# Altium schematic sheet AD_2.SchDoc
size A2; Date: Date; CompanyName: HESSO; Engineer: Name; Address1: Route du Rawyl 47; Address2: 1950 Sion; Address3: Switzerland; DocumentNumber: 7; SheetNumber: 7; SheetTotal: 8; ProjectName: Project Name
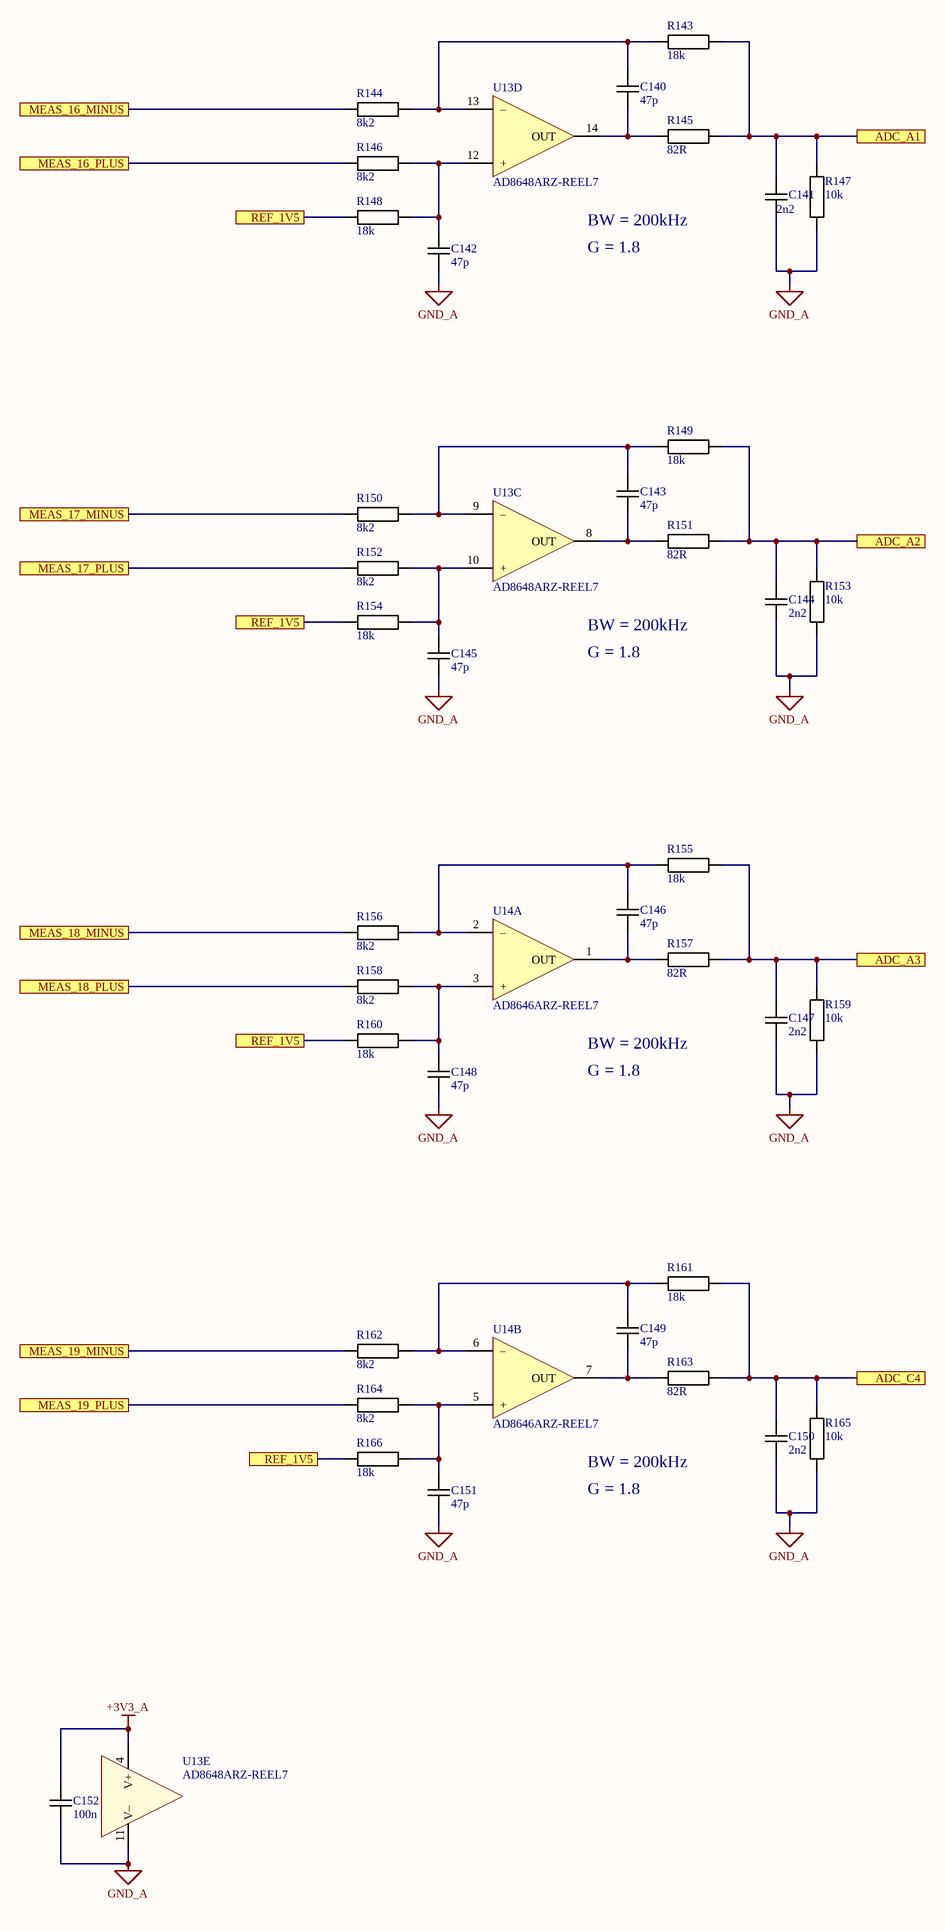
[diagram p0: AD_2.SchDoc]

## Parts
C140  47p  [CAPACITOR 1608 REFLOW]
C141  2n2  [CAPACITOR 1608 REFLOW]
C142  47p  [CAPACITOR 1608 REFLOW]
C143  47p  [CAPACITOR 1608 REFLOW]
C144  2n2  [CAPACITOR 1608 REFLOW]
C145  47p  [CAPACITOR 1608 REFLOW]
C146  47p  [CAPACITOR 1608 REFLOW]
C147  2n2  [CAPACITOR 1608 REFLOW]
C148  47p  [CAPACITOR 1608 REFLOW]
C149  47p  [CAPACITOR 1608 REFLOW]
C150  2n2  [CAPACITOR 1608 REFLOW]
C151  47p  [CAPACITOR 1608 REFLOW]
C152  100n  [CAPACITOR 1608 REFLOW]
R143  18k  [RESISTOR 1608 REFLOW]
R144  8k2  [RESISTOR 1608 REFLOW]
R145  82R  [RESISTOR 1608 REFLOW]
R146  8k2  [RESISTOR 1608 REFLOW]
R147  10k  [RESISTOR 1608 REFLOW]
R148  18k  [RESISTOR 1608 REFLOW]
R149  18k  [RESISTOR 1608 REFLOW]
R150  8k2  [RESISTOR 1608 REFLOW]
R151  82R  [RESISTOR 1608 REFLOW]
R152  8k2  [RESISTOR 1608 REFLOW]
R153  10k  [RESISTOR 1608 REFLOW]
R154  18k  [RESISTOR 1608 REFLOW]
R155  18k  [RESISTOR 1608 REFLOW]
R156  8k2  [RESISTOR 1608 REFLOW]
R157  82R  [RESISTOR 1608 REFLOW]
R158  8k2  [RESISTOR 1608 REFLOW]
R159  10k  [RESISTOR 1608 REFLOW]
R160  18k  [RESISTOR 1608 REFLOW]
R161  18k  [RESISTOR 1608 REFLOW]
R162  8k2  [RESISTOR 1608 REFLOW]
R163  82R  [RESISTOR 1608 REFLOW]
R164  8k2  [RESISTOR 1608 REFLOW]
R165  10k  [RESISTOR 1608 REFLOW]
R166  18k  [RESISTOR 1608 REFLOW]
U13  AD8648ARZ-REEL7  [SO14 P1.27 C4.0X8.8 H1.75]  (parts C,D,E of 5)
U14  AD8646ARZ-REEL7  [SO8 P1.27 C4.0X5.0 H1.75]  (parts A,B of 3)

## Ports
ADC_A1, ADC_A2, ADC_A3, ADC_C4, MEAS_16_MINUS, MEAS_16_PLUS, MEAS_17_MINUS, MEAS_17_PLUS, MEAS_18_MINUS, MEAS_18_PLUS, MEAS_19_MINUS, MEAS_19_PLUS, REF_1V5

## Nets
+3V3_A: C152.2 U13.4(V+)
GND_A: C141.1 C142.1 C144.1 C145.1 C147.1 C148.1 C150.1 C151.1 C152.1 R147.2 R153.2 R159.2 R165.2 U13.11(V–)
ADC_A1: C141.2 R143.2 R145.2 R147.1 ; port ADC_A1
ADC_A2: C144.2 R149.2 R151.2 R153.1 ; port ADC_A2
ADC_A3: C147.2 R155.2 R157.2 R159.1 ; port ADC_A3
ADC_C4: C150.2 R161.2 R163.2 R165.1 ; port ADC_C4
MEAS_16_MINUS: R144.1 ; port MEAS_16_MINUS
MEAS_16_PLUS: R146.1 ; port MEAS_16_PLUS
MEAS_17_MINUS: R150.1 ; port MEAS_17_MINUS
MEAS_17_PLUS: R152.1 ; port MEAS_17_PLUS
MEAS_18_MINUS: R156.1 ; port MEAS_18_MINUS
MEAS_18_PLUS: R158.1 ; port MEAS_18_PLUS
MEAS_19_MINUS: R162.1 ; port MEAS_19_MINUS
MEAS_19_PLUS: R164.1 ; port MEAS_19_PLUS
REF_1V5: R148.2 R154.2 R160.2 R166.2 ; port REF_1V5
NetC140_1: C140.1 R145.1 U13.14(OUT)
NetC140_2: C140.2 R143.1 R144.2 U13.13(–)
NetC142_2: C142.2 R146.2 R148.1 U13.12(+)
NetC143_1: C143.1 R151.1 U13.8(OUT)
NetC143_2: C143.2 R149.1 R150.2 U13.9(–)
NetC145_2: C145.2 R152.2 R154.1 U13.10(+)
NetC146_1: C146.1 R157.1 U14.1(OUT)
NetC146_2: C146.2 R155.1 R156.2 U14.2(–)
NetC148_2: C148.2 R158.2 R160.1 U14.3(+)
NetC149_1: C149.1 R163.1 U14.7(OUT)
NetC149_2: C149.2 R161.1 R162.2 U14.6(–)
NetC151_2: C151.2 R164.2 R166.1 U14.5(+)

## Notes on the sheet
- BW = 200kHz
- G = 1.8
- Date :
- Revision :
- Sheet
- of
- Design by :

## Library data of the parts
C140-C152 = Capacitor: Capacitor X7R 10% 50V 1608(0603)
  C140 C142 C143 C145 C146 C148 C149 C151: Value: 47p
  C141 C144 C147 C150: Value: 2n2
  C152: Value: 100n
R143-R166 = Resistor: Resistor 1% 50V 100mW 1608(0603)
  R143 R148 R149 R154 R155 R160 R161 R166: Value: 18k
  R144 R146 R150 R152 R156 R158 R162 R164: Value: 8k2
  R145 R151 R157 R163: Value: 82R
  R147 R153 R159 R165: Value: 10k
U13 = OPA QUAD: Generic quad OPA 14 pins; Manufacturer: Analog Device; Value: AD8648ARZ-REEL7; Mouser No.: 584-AD8648ARZ-R7
U14 = OPA DUAL: Generic dual OPA 8 pins; Manufacturer: Analog Devices; Value: AD8646ARZ-REEL7; Mouser No.: 584-AD8646ARZ-R7